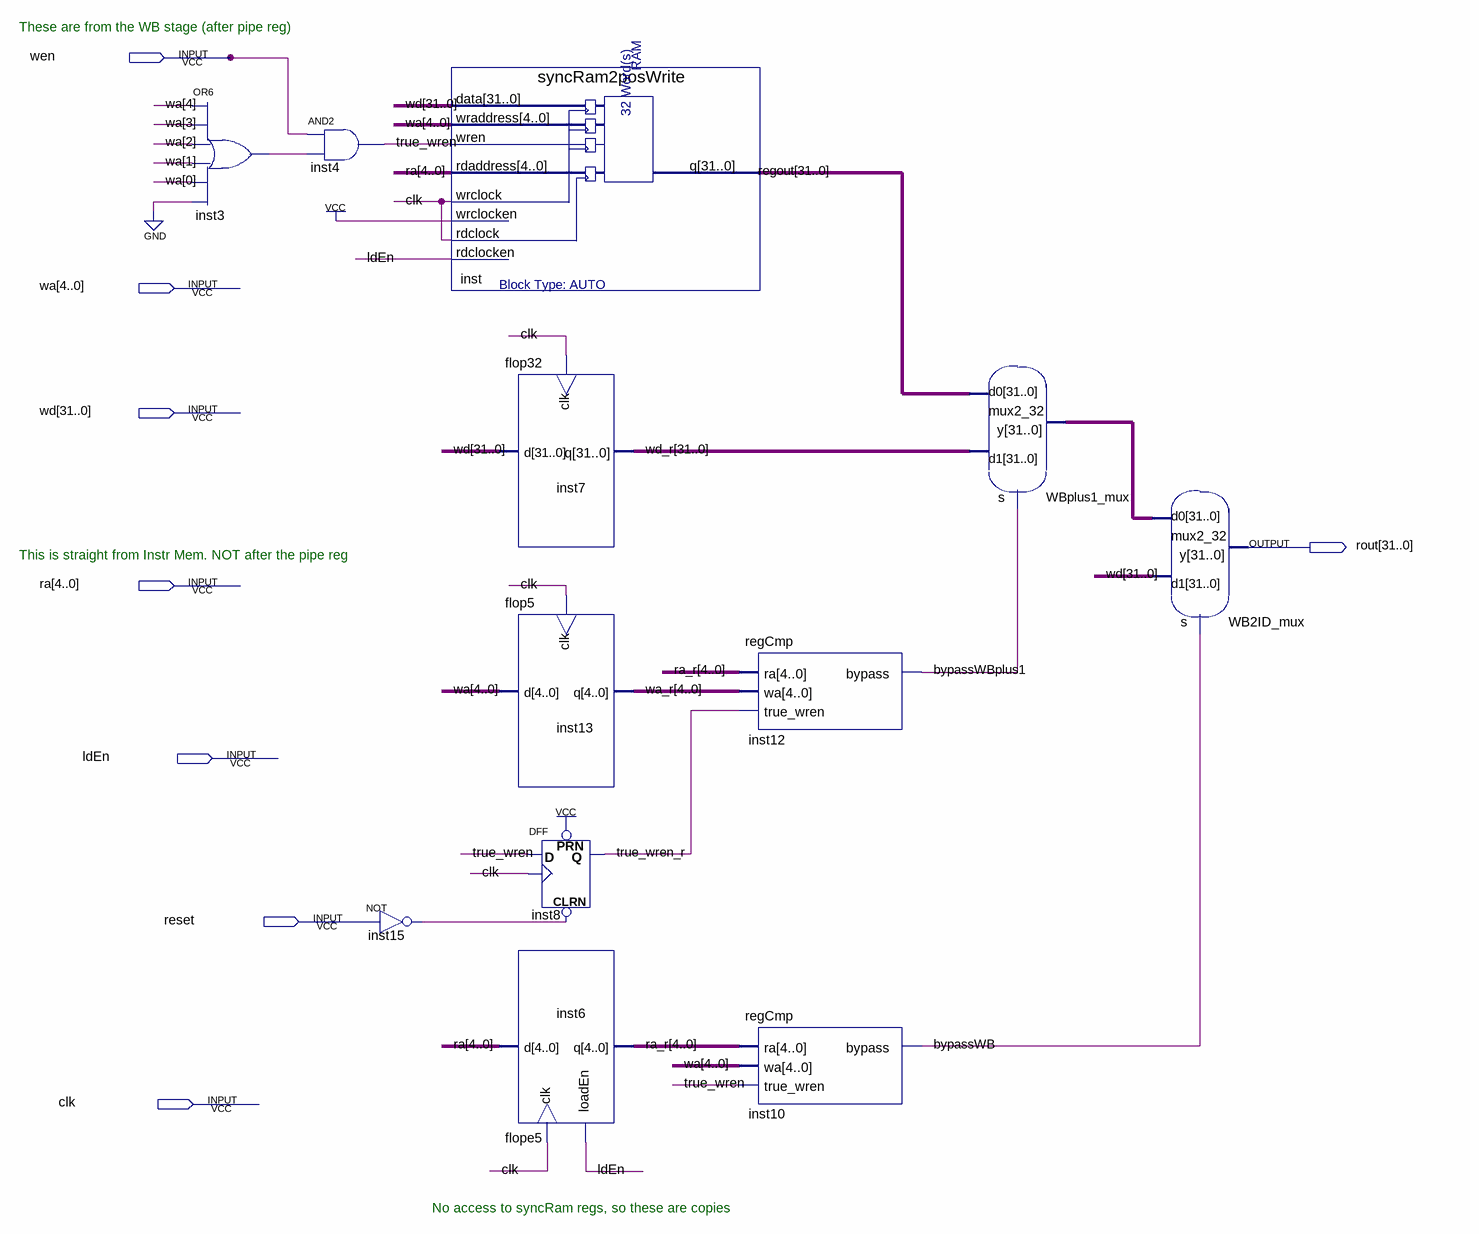
[diagram p0: schematic sheet]
// Quartus schematic rfPosEdge.bdf as structural Verilog: 12 symbols, 8 pins
module rfPosEdge (
  input  wen,
  input  [4:0] wa,
  input  [31:0] wd,
  input  [4:0] ra,
  input  ldEn,
  input  reset,
  input  clk,
  output [31:0] rout
);

  wire bypassWB, bypassWBplus1, inst3_out, inst15_out, true_wren, true_wren_r;
  wire [4:0] ra_r, wa_r;
  wire [31:0] regout, WBplus1_mux_y, wd_r;

  or inst3 (inst3_out, wa[4], wa[3], wa[2], wa[1], wa[0], 1'b0);
  and inst4 (true_wren, wen, inst3_out);
  not inst15 (inst15_out, reset);
  syncRam2posWrite inst (
    .data(wd), .wraddress(wa), .wren(true_wren), .rdaddress(ra), .wrclock(clk), .wrclocken(1'b1),
    .rdclock(clk), .rdclocken(ldEn), .q(regout));
  flop32 inst7 (.clk(clk), .d(wd), .q(wd_r));
  flop5 inst13 (.clk(clk), .d(wa), .q(wa_r));
  flope5 inst6 (.clk(clk), .loadEn(ldEn), .d(ra), .q(ra_r));
  DFF inst8 (.CLRN(inst15_out), .CLK(clk), .D(true_wren), .PRN(1'b1), .Q(true_wren_r));
  regCmp inst12 (.ra(ra_r), .wa(wa_r), .true_wren(true_wren_r), .bypass(bypassWBplus1));
  regCmp inst10 (.ra(ra_r), .wa(wa), .true_wren(true_wren), .bypass(bypassWB));
  mux2_32 WBplus1_mux (.d0(regout), .d1(wd_r), .s(bypassWBplus1), .y(WBplus1_mux_y));
  mux2_32 WB2ID_mux (.d0(WBplus1_mux_y), .d1(wd), .s(bypassWB), .y(rout));

  // Notes on the sheet:
  //   These are from the WB stage (after pipe reg)
  //   This is straight from Instr Mem. NOT after the pipe reg
  //   No access to syncRam regs, so these are copies
endmodule
